# EasyEDA Pro project ProPrj_USB-DAC-PRO_2024-06-16.epro, board PCB1
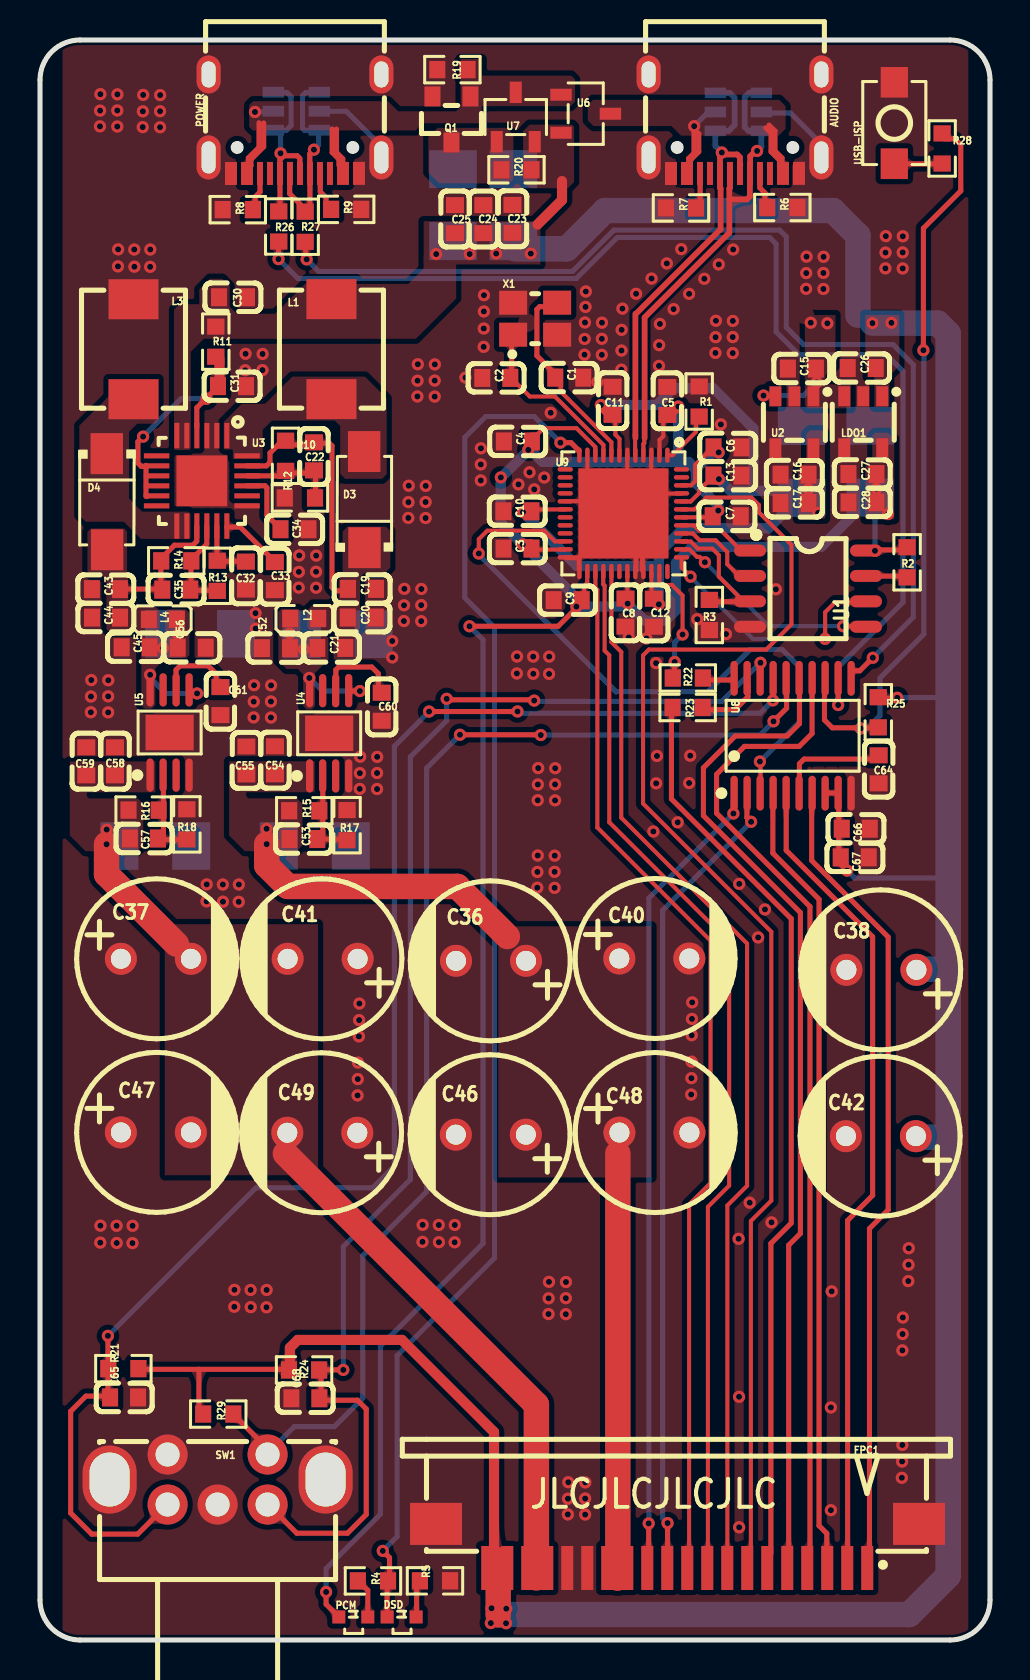
[diagram p6: board, top side]
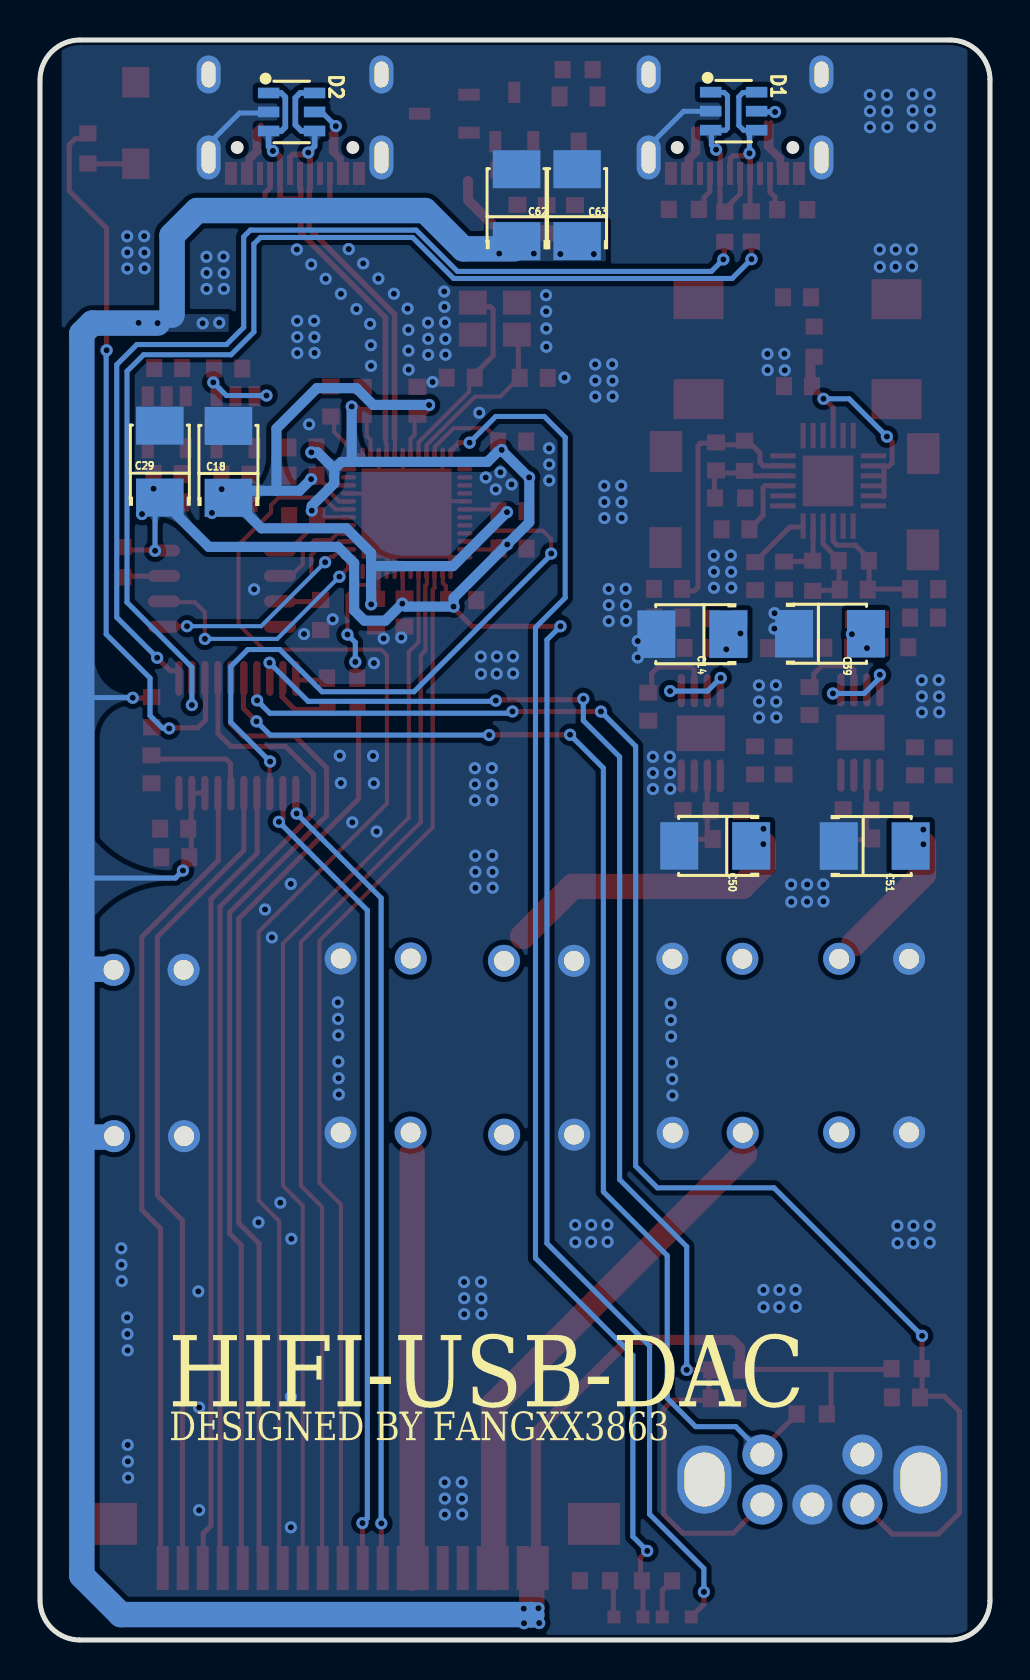
[diagram p7: board, bottom side, seen from below]

Outline 47.5 x 80 mm; copper layers: Top Layer, Bottom Layer. Coordinates in mm from the lower left corner of the outline.
Outline path: 0,78 0,2 arc(0.59,0.59) 2,0 45.5,0 arc(46.91,0.59) 47.5,2 47.5,78 arc(46.91,79.41) 45.5,80 2,80 arc(0.59,79.41) 0,78
Stack: Top Layer 0.035mm - / Dielectric1 1.51mm FR4 er 4.5 / Bottom Layer 0.035mm -

## Design rules (mm)
net USB_D+: AUDIO_USB
net USB_D-: AUDIO_USB
template: 自定义配置
spacing copperThickness1oz (default): track to track 0.102, other pairs 0.152 to 0.3
spacing copperThickness2oz: track to track 0.203, other pairs 0.152 to 0.3
track width copperThickness1oz (default): min 0.127, default 0.254, max 2.54
track width copperThickness2oz: min 0.203, default 0.254, max 2.54
differential pair differentialPair (default): width min 0.127, default 0.254, max 2.54; gap min 0.152, default 0.152
differential pair USB: width min 0.203, default 0.284, max 2.54; gap min 0.152, default 0.152
via viaSize (default): diameter min 0.5, default 0.61, max 10; hole min 0.3, default 0.305, max 6.299
net USB_D+ uses USB
net USB_D- uses USB
diff pair AUDIO_USB uses USB
pour e454 uses USB

## Placement (name value [footprint] x y rotation side)
AUDIO  CQ-USB- TYPE-C 16P母座四脚插板有柱  [USB-C-SMD_CQ-USB-TYPE-C]  34.75 75.8 180 top
C1  20pF  [C0603]  26.46 63.12 0 top
C2  20pF  [C0603]  22.81 63.1 0 top
C3  100nF  [C0603]  23.87 54.57 0 top
C4  100nF  [C0603]  23.89 59.93 0 top
C5  100nF  [C0603]  31.37 61.95 270 top
C6  100nF  [C0603]  34.38 59.63 180 top
C7  100nF  [C0603]  34.34 56.19 180 top
C8  100nF  [C0603]  29.28 51.37 90 top
C9  100nF  [C0603]  26.38 51.99 0 top
C10  100nF  [C0603]  23.87 56.44 0 top
C11  100nF  [C0603]  28.63 61.96 270 top
C12  100nF  [C0603]  30.69 51.36 90 top
C13  100nF  [C0603]  34.37 58.22 180 top
C14  47uF  [CAP-SMD_L3.5-W2.8-FD]  14.88 50.29 0 bottom
C15  4.7uF  [C0603]  38.09 63.57 0 top
C16  4.7uF  [C0603]  37.73 58.27 0 top
C17  100nF  [C0603]  37.73 56.85 0 top
C18  47uF  [CAP-SMD_L3.5-W2.8-FD]  38.08 58.91 90 bottom
C19  10uF  [C0603]  16.1 52.56 180 top
C20  0.1uF  [C0603]  16.09 51.12 180 top
C21  22uF  [C0603]  14.57 49.6 180 top
C22  56pF  [C0603]  13.7 59.18 90 top
C23  100nF  [C0603]  23.62 71.06 270 top
C24  4.7uF  [C0603]  22.17 71.04 270 top
C25  10uF  [C0603]  20.75 71.04 270 top
C26  4.7uF  [C0603]  41.09 63.6 0 top
C27  4.7uF  [C0603]  41.12 58.3 0 top
C28  100nF  [C0603]  41.12 56.88 0 top
C29  47uF  [CAP-SMD_L3.5-W2.8-FD]  41.51 58.92 90 bottom
C30  4.7uF  [C0603]  9.65 67.14 0 top
C31  0.1uF  [C0603]  9.6 62.69 180 top
C32  220nF  [C0603]  10.3 53.22 90 top
C33  4.7nF  [C0603]  11.74 53.19 90 top
C34  10nF  [C0603]  12.72 55.54 180 top
C35  56pF  [C0603]  6.81 52.52 0 top
C36  470uF  [CAP-TH_BD8.0-P3.50-D0.6-FD]  22.55 33.96 180 top
C37  470uF  [CAP-TH_BD8.0-P3.50-D0.6-FD]  5.79 34.06 0 top
C38  470uF  [CAP-TH_BD8.0-P3.50-D0.6-FD]  42.07 33.51 180 top
C39  47uF  [CAP-SMD_L3.5-W2.8-FD]  8 50.31 180 bottom
C40  470uF  [CAP-TH_BD8.0-P3.50-D0.6-FD]  30.72 34.07 0 top
C41  470uF  [CAP-TH_BD8.0-P3.50-D0.6-FD]  14.13 34.06 180 top
C42  470uF  [CAP-TH_BD8.0-P3.50-D0.6-FD]  42.05 25.19 180 top
C43  10uF  [C0603]  3.3 52.54 0 top
C44  0.1uF  [C0603]  3.3 51.12 0 top
C45  22uF  [C0603]  4.78 49.63 0 top
C46  470uF  [CAP-TH_BD8.0-P3.50-D0.6-FD]  22.54 25.27 180 top
C47  470uF  [CAP-TH_BD8.0-P3.50-D0.6-FD]  5.79 25.38 0 top
C48  470uF  [CAP-TH_BD8.0-P3.50-D0.6-FD]  30.72 25.37 0 top
C49  470uF  [CAP-TH_BD8.0-P3.50-D0.6-FD]  14.12 25.36 180 top
C50  47uF  [CAP-SMD_L3.5-W2.8-FD]  13.74 39.7 0 bottom
C51  47uF  [CAP-SMD_L3.5-W2.8-FD]  5.76 39.7 180 bottom
C52  10uF  [C0603]  11.8 49.59 0 top
C53  10nF  [C0603]  13.17 40.05 180 top
C54  0.1uF  [C0603]  11.75 43.98 270 top
C55  10uF  [C0603]  10.32 43.97 270 top
C56  10uF  [C0603]  7.58 49.62 180 top
C57  10nF  [C0603]  5.2 40.08 180 top
C58  0.1uF  [C0603]  3.75 43.93 270 top
C59  10uF  [C0603]  2.31 43.93 270 top
C60  10nF  [C0603]  17.09 46.66 90 top
C61  10nF  [C0603]  9.02 46.94 90 top
C62  47uF  [CAP-SMD_L3.5-W2.8-FD]  23.67 71.74 90 bottom
C63  47uF  [CAP-SMD_L3.5-W2.8-FD]  20.65 71.74 90 bottom
C64  100nF  [C0603]  41.93 43.53 270 top
C65  100nF  [C0603]  4.2 12.13 180 top
C66  22uF  [C0603]  40.79 40.57 180 top
C67  100nF  [C0603]  40.74 39.13 180 top
C68  100nF  [C0603]  13.27 12.09 0 top
D1  TPUSBLC6-4SC6  [SOT-23-6_L2.9-W1.6-P0.95-LS2.8-BL]  12.82 76.44 270 bottom
D2  TPUSBLC6-4SC6  [SOT-23-6_L2.9-W1.6-P0.95-LS2.8-BL]  34.92 76.4 270 bottom
D3  SS34  [SMA_L4.3-W2.6-LS5.0-RD]  16.22 57.02 90 top
D4  SS34  [SMA_L4.3-W2.6-LS5.0-RD]  3.35 56.91 270 top
DSD  侧发绿光LEDD0602  [LED-SMD_L1.6-W1.1-R-RD_BLUE]  18.08 1.15 180 top
FPC1  AFA07-S20FCC-00  [FPC-SMD_AFA07-S20FCC-00]  31.88 4.7 180 top
L1  4.7uH  [IND-SMD_L5.9-W5.2_MAPM0530F]  14.57 64.54 270 top
L2  4.7uH  [L0603]  13.21 51.07 180 top
L3  4.7uH  [IND-SMD_L5.9-W5.2_MAPM0530F]  4.67 64.54 270 top
L4  4.7uH  [L0603]  6.14 51.03 0 top
LDO1  LP5907MFX-3.3/NOPB  [SOT-23-5_L3.0-W1.7-P0.95-LS2.8-BR]  41.16 60.89 90 top
PCM  侧发蓝光LEDD0602  [LED-SMD_L1.6-W1.1-R-RD_BLUE]  15.67 1.15 180 top
POWER  CQ-USB- TYPE-C 16P母座四脚插板有柱  [USB-C-SMD_CQ-USB-TYPE-C]  12.75 75.8 180 top
Q1  AO3402  [SOT-23_L2.9-W1.3-P1.90-LS2.4-BR]  20.57 76.03 90 top
R1  1.8K  [R0603]  32.96 61.92 270 top
R2  10K  [R0603]  43.36 53.89 90 top
R3  10K  [R0603]  33.47 51.25 90 top
R4  470R  [R0603]  16.65 2.95 180 top
R5  470R  [R0603]  19.75 2.96 180 top
R6  5.1K  [R0603]  37.12 71.62 180 top
R7  5.1K  [R0603]  32.05 71.6 0 top
R8  5.1K  [R0603]  9.89 71.52 0 top
R9  5.1K  [R0603]  15.31 71.53 180 top
R10  620K  [R0603]  12.28 59.21 90 top
R11  100R  [R0603]  8.79 64.92 270 top
R12  56K  [R0603]  13 57.1 0 top
R13  18K  [R0603]  8.86 53.21 270 top
R14  220K  [R0603]  6.81 53.96 0 top
R15  120K  [R0603]  13.21 41.46 180 top
R16  120K  [R0603]  5.18 41.5 180 top
R17  11K  [R0603]  15.35 40.74 270 top
R18  11K  [R0603]  7.34 40.78 270 top
R19  1K  [R0603]  20.62 78.52 180 top
R20  1K  [R0603]  23.82 73.51 0 top
R21  10K  [R0603]  4.17 13.57 0 top
R22  1K  [R0603]  32.39 48.1 180 top
R23  1K  [R0603]  32.38 46.62 180 top
R24  10K  [R0603]  13.2 13.5 180 top
R25  10K  [R0603]  41.91 46.39 90 top
R26  22R  [R0603]  11.94 70.68 90 top
R27  22R  [R0603]  13.26 70.66 90 top
R28  300R  [R0603]  45.11 74.58 90 top
R29  10K  [R0603]  8.91 11.3 0 top
SW1  EC11B15242AZ  [SW-TH_EC11B1524XX]  8.88 8.02 270 top
U1  GD25Q40CSIGR  [SOP-8_L4.9-W3.9-P1.27-LS6.0-BR]  38.4 52.57 180 top
U2  LP5907MFX-1.2/NOPB  [SOT-23-5_L3.0-W1.7-P0.95-LS2.8-BR]  37.72 60.88 90 top
U3  TPS65131RGER  [QFN24_L]  8.09 57.96 270 top
U4  TPS7A4901DGNR  [MSOP-8_L3.0-W3.0-P0.65-LS5.0-BL-EP]  14.46 45.34 0 top
U5  TPS7A3001DGNR  [MSOP-8_L3.0-W3.0-P0.65-LS5.0-BL-EP]  6.48 45.38 0 top
U6  AO3401  [SOT-23-3_L2.9-W1.6-P1.90-LS2.8-BR]  27.29 76.32 180 top
U7  AO3401  [SOT-23-3_L2.9-W1.6-P1.90-LS2.8-BR]  23.79 76.15 270 top
U8  STC8H8K64U-45I-TSSOP20  [TSSOP-20_L6.5-W4.4-P0.65-LS6.4-BL]  37.63 45.21 0 top
U9  CT7601SR-QFN48  [qfn-48_l6.0-w6.0-p0.40-tl-ep4.5]  29.17 56.33 270 top
USB-ISP  -  [Key_SMD_3x4x2]  42.71 75.85 90 top
X1  12MHz  [OSC-SMD_4P-L3.2-W2.5-BL-1]  24.76 66.06 0 top

## Footprints (pads in the part's own frame, mm; a bottom-side part is the same pattern mirrored in y, then rotated)
C0603
  rect 0.8x0.9 smd: 1(-0.7,0) 2(0.7,0)
CAP-SMD_L3.5-W2.8-FD
  rect 1.9x2.376 smd: 1(-1.798,0) 2(1.798,0)
CAP-TH_BD8.0-P3.50-D0.6-FD
  round 1.6 hole 1: 1(-1.75,0) 2(1.75,0)
FPC-SMD_AFA07-S20FCC-00
  rect 0.6x2.2 smd: 1(-9.486,1.103) 2(-8.486,1.103) 3(-7.484,1.103) 4(-6.486,1.103) 5(-5.486,1.103) 6(-4.486,1.101) 7(-3.486,1.103) 8(-2.486,1.103) 9(-1.487,1.102) 10(-0.487,1.102) 11(0.513,1.102) 12(1.513,1.102) 13(2.513,1.102) 14(3.513,1.102) 15(4.515,1.101) 16(5.514,1.102) 17(6.514,1.102) 18(7.514,1.102) 19(8.514,1.102) 20(9.513,1.102)
  rect 2.6x2.1 smd: 21(-12.075,-1.103) 22(12.075,-1.103)
IND-SMD_L5.9-W5.2_MAPM0530F
  rect 2x2.5 smd: 1(-2.5,0) 2(2.5,0)
Key_SMD_3x4x2
  rect 1.53x1.36 smd: 1(-2.035,0) 2(2.035,0)
L0603
  rect 0.8x0.864 smd: 1(-0.7,0) 2(0.7,0)
LED-SMD_L1.6-W1.1-R-RD_BLUE
  rect 0.65x0.65 smd: 1(0.725,0) 2(-0.725,0)
MSOP-8_L3.0-W3.0-P0.65-LS5.0-BL-EP
  oval 0.364x1.662 smd: 1(-0.975,-2.131) 2(-0.325,-2.131) 3(0.325,-2.131) 4(0.975,-2.131) 5(0.975,2.131) 6(0.325,2.131) 7(-0.325,2.131) 8(-0.975,2.131)
  rect 2.41x1.78 smd: 9(0,0)
OSC-SMD_4P-L3.2-W2.5-BL-1
  rect 1.4x1.2 smd: 1(-1.1,-0.8) 2(1.1,-0.8) 3(1.1,0.8) 4(-1.1,0.8)
QFN24_L
  rect 1.27x0.254 smd: 1(-2.26,1.25) 2(-2.261,0.75) 3(-2.261,0.251) 4(-2.261,-0.251) 5(-2.263,-0.75) 6(-2.264,-1.252) 13(2.26,-1.25) 14(2.26,-0.75) 15(2.26,-0.25) 16(2.26,0.25) 17(2.26,0.75) 18(2.26,1.25)
  rect 0.254x1.27 smd: 7(-1.25,-2.261) 8(-0.75,-2.261) 9(-0.25,-2.261) 10(0.25,-2.261) 11(0.75,-2.261) 12(1.25,-2.261) 19(1.25,2.261) 20(0.75,2.261) 21(0.25,2.261) 22(-0.25,2.261) 23(-0.75,2.261) 24(-1.25,2.261)
  rect 2.54x2.54 smd: 25(0,0)
qfn-48_l6.0-w6.0-p0.40-tl-ep4.5
  oval 0.765x0.224 smd: 1(-2.908,2.2) 2(-2.908,1.8) 3(-2.908,1.4) 4(-2.908,1) 5(-2.908,0.6) 6(-2.908,0.2) 7(-2.908,-0.2) 8(-2.908,-0.6) 9(-2.908,-1) 10(-2.908,-1.4) 11(-2.908,-1.8) 12(-2.908,-2.2) 25(2.908,-2.2) 26(2.908,-1.8) 27(2.908,-1.4) 28(2.908,-1) 29(2.908,-0.6) 30(2.908,-0.2) 31(2.908,0.2) 32(2.908,0.6) 33(2.908,1) 34(2.908,1.4) 35(2.908,1.8) 36(2.908,2.2)
  oval 0.224x0.765 smd: 13(-2.2,-2.908) 14(-1.8,-2.908) 15(-1.4,-2.908) 16(-1,-2.908) 17(-0.6,-2.908) 18(-0.2,-2.908) 19(0.2,-2.908) 20(0.6,-2.908) 21(1,-2.908) 22(1.4,-2.908) 23(1.8,-2.908) 24(2.2,-2.908) 37(2.2,2.908) 38(1.8,2.908) 39(1.4,2.908) 40(1,2.908) 41(0.6,2.908) 42(0.2,2.908) 43(-0.2,2.908) 44(-0.6,2.908) 45(-1,2.908) 46(-1.4,2.908) 47(-1.8,2.908) 48(-2.2,2.908)
  rect 4.5x4.5 smd: 49(0,0)
R0603
  rect 0.806x0.864 smd: 1(-0.753,0) 2(0.753,0)
SMA_L4.3-W2.6-LS5.0-RD
  rect 2.046x1.62 smd: 1(-2.404,-0.009) 2(2.404,0.009)
SOP-8_L4.9-W3.9-P1.27-LS6.0-BR
  oval 1.6x0.6 smd: 1(2.9,-1.905) 2(2.9,-0.635) 3(2.9,0.635) 4(2.9,1.905) 5(-2.9,1.905) 6(-2.9,0.635) 7(-2.9,-0.635) 8(-2.9,-1.905)
SOT-23-3_L2.9-W1.6-P1.90-LS2.8-BR
  rect 1.07x0.6 smd: 1(1.235,-0.95) 2(1.235,0.95) 3(-1.235,0)
SOT-23-5_L3.0-W1.7-P0.95-LS2.8-BR
  rect 1x0.6 smd: 1(1.3,-0.95) 2(1.3,0) 3(1.3,0.95) 4(-1.3,0.95) 5(-1.3,-0.95)
SOT-23-6_L2.9-W1.6-P0.95-LS2.8-BL
  rect 0.532x1.072 smd: 1(-0.95,-1.149) 2(0,-1.149) 3(0.95,-1.149) 4(0.95,1.149) 5(0,1.149) 6(-0.95,1.149)
SOT-23_L2.9-W1.3-P1.90-LS2.4-BR
  rect 1x0.8 smd: 1(1.15,-0.95) 2(1.15,0.95) 3(-1.15,0)
SW-TH_EC11B1524XX
  round 2 hole 1.2: A(1.25,-2.5) B(1.25,2.5) C(1.25,-0.001) D(-1.25,-2.5) E(-1.25,2.5)
  oval 3.4x2.7 hole 2.7x2: EH(0,5.4) EH(0,-5.4)
TSSOP-20_L6.5-W4.4-P0.65-LS6.4-BL
  oval 0.364x1.742 smd: 1(-2.925,-2.871) 2(-2.275,-2.871) 3(-1.625,-2.871) 4(-0.975,-2.871) 5(-0.325,-2.871) 6(0.325,-2.871) 7(0.975,-2.871) 8(1.625,-2.871) 9(2.275,-2.871) 10(2.925,-2.871) 11(2.925,2.871) 12(2.275,2.871) 13(1.625,2.871) 14(0.975,2.871) 15(0.325,2.871) 16(-0.325,2.871) 17(-0.975,2.871) 18(-1.625,2.871) 19(-2.275,2.871) 20(-2.925,2.871)
USB-C-SMD_CQ-USB-TYPE-C
  oval 1.2x2.2 hole 0.7x1.6: 0(-4.32,1.675) 0(4.32,1.675)
  oval 1.2x1.9 hole 0.7x1.3: 0(-4.32,-2.475) 0(4.32,-2.475)
  rect 0.6x1.15 smd: A1B12(-3.2,2.471) A4B9(-2.4,2.471) B1A12(3.2,2.475) B4A9(2.4,2.475)
  rect 0.3x1.15 smd: A5(-1.25,2.475) A6(-0.25,2.475) A7(0.25,2.474) A8(1.25,2.475) B5(1.75,2.475) B6(0.75,2.475) B7(-0.75,2.473) B8(-1.75,2.475)

## Nets
As in the schematic.

Pads without a net: AUDIO A8 B8; POWER A8 B8; U3 7 12 20; U4 3 7; U5 3 7; U9 13 19 20 21 47 48

## Via types
v1: diameter 0.61, hole 0.305, Top Layer to Bottom Layer, 309 vias

## Routing (per net, layer and track width the routed paths; a pad name or vN(x,y) marks a point on that pad's centre or on a via; arc(x,y) is an arc through that point)
5V: length 166.6
  Top Layer w0.254: v1(40.35,38.47) 40.01,38.82 40.01,39.07 40.08,39.15 ; v1(36.18,62.22) 36.18,62.21 36.75,62.21 ; 4.96,13.62 5.04,13.53 7.95,13.53 ; v1(42.86,47.11) 42.84,47.09 41.86,47.09 ; 8.02,11.57 7.95,11.65 7.95,13.53 ; 7.95,13.53 12.5,13.53 ; 39.92,39.12 39.94,39.14 39.94,41.97 ; 39.3,42.35 39.84,42.35 39.93,42.25
  Top Layer w0.508: 22.7,3.39 22.7,10.4 18.09,15 12.89,15 12.5,14.61 12.5,13.64 ; 24.87,70.77 26.1,72 26.1,72.95
  Top Layer w1.27: 22.84,4.04 22.91,3.97 22.91,1.26
  Bottom Layer w0.254: 45.41,38.1 40.73,38.1 v1(40.35,38.47) ; v1(38.84,62.88) 38.18,62.22 v1(36.18,62.22) ; 45.19,47.12 42.87,47.12 v1(42.86,47.11)
  Bottom Layer w1.27: 22.91,1.26 22.93,1.27 43.46,1.27 45.41,3.22 45.41,25.14 ; 45.41,33.54 45.41,25.14 ; 45.41,33.54 45.41,65.32 44.89,65.84 v1(41.62,65.84) ; 45.41,33.54 44.05,33.54 44.02,33.51 ; 45.41,25.14 43.82,25.14 ; 40.9,66.24 40.9,70.23 39.65,71.47 28.25,71.47 26.34,69.56 23.77,69.56
  vias: v1(19.81,69.3) v1(21.48,69.3) v1(22.58,1.59) v1(22.54,0.85) v1(22.81,69.32) v1(23.31,1.57) v1(23.3,0.84) v1(24.54,69.32) v1(38.54,65.86) v1(39.37,65.83) v1(42.57,65.86)
+15V: length 3.3
  Top Layer w0.254: v1(15.99,47.45) 15.99,47.45 15.45,47.45
  Bottom Layer w0.254: v1(15.99,47.45) 14.12,47.45 v1(13.47,48.1)
  vias: v1(12.48,50.33) v1(13.19,49.53)
-15V: length 3.2
  Top Layer w0.254: 7.5,47.33 v1(7.85,47.33)
  Bottom Layer w0.254: v1(5.51,48.26) 5.51,48.11 6.29,47.33 v1(7.85,47.33)
  vias: v1(6.15,49.59) v1(6.91,50.29)
GND: length 16.4
  Top Layer w0.203: 30.54,58.28 30.56,58.3 30.56,59.19 ; 27.52,56.83 27.41,56.94 26.3,56.94 ; 30.77,57.34 30.79,57.32 32.09,57.32 ; 27.37,59.01 27.37,58.16 27.35,58.15 ; 29.36,59.25 29.36,58.14 29.36,58.13
  Top Layer w0.254: 30.13,53.48 30.13,54.41 30.11,54.42 ; 26.96,53.54 26.96,54.1 ; 26.96,54.1 26.97,54.09 ; 26.96,54.1 26.95,54.11 26.3,54.11 ; 26.96,54.1 26.96,54.12 27.2,54.37 ; 29.8,54.57 29.8,53.5 29.79,53.48
  Bottom Layer w0.254: 14.16,76.44 15.32,76.44 16.88,74.87 ; 36.08,76.35 37.52,76.35 39.1,74.77 39.1,74.56
  vias: v1(2.56,48) v1(2.55,47.17) v1(2.54,46.39) v1(3,75.68) v1(3.02,77.29) v1(3,76.47) v1(3.02,20.72) v1(3.01,19.87) v1(3.41,47.99) v1(3.41,47.18) v1(3.41,46.38) v1(3.87,77.28) v1(3.86,76.48) v1(3.86,75.68) v1(3.9,68.68) v1(3.83,20.71) v1(3.83,19.85) v1(3.91,69.53) v1(4.63,20.71) v1(4.62,19.84) v1(4.71,69.52) v1(4.72,68.66) v1(5.16,77.25) v1(5.14,76.43) v1(5.14,75.64) v1(5.51,69.52) v1(5.51,68.66) v1(6.01,77.25) v1(6,76.44) v1(6,75.64) v1(8.33,37.78) v1(8.33,36.93) v1(9.14,37.77) v1(9.15,36.91) v1(9.72,17.51) v1(9.71,16.66) v1(9.94,37.77) v1(9.94,36.91) v1(10.28,64.31) v1(10.26,63.49) v1(10.53,17.5) v1(10.54,16.64) v1(10.69,46.92) v1(10.68,46.13) v1(10.77,51.34) v1(10.78,50.57) v1(10.7,47.74) v1(11.13,64.3) v1(11.12,63.49) v1(11.33,17.5) v1(11.32,16.64) v1(11.55,47.73) v1(11.55,46.92) v1(11.55,46.12) v1(12.96,54.23) v1(12.94,53.41) v1(12.94,52.62) v1(13.81,54.22) v1(13.8,53.41) v1(13.8,52.61) v1(15.89,28.05) v1(15.88,27.23) v1(15.99,43.34) v1(15.99,42.56) v1(15.97,31.82) v1(15.96,31) v1(15.94,30.18) v1(15.9,28.87) v1(16.01,44.16) v1(16.86,44.16) v1(16.85,43.35) v1(16.85,42.55) v1(17.61,49.95) v1(17.61,49.13) v1(18.19,50.95) v1(18.22,52.56) v1(18.2,51.74) v1(18.44,57.71) v1(18.42,56.89) v1(18.41,56.1) v1(18.89,63.79) v1(18.88,62.97) v1(18.87,62.18) v1(19.07,52.55) v1(19.06,51.74) v1(19.06,50.94) v1(19.13,20.76) v1(19.12,19.91) v1(19.29,57.71) v1(19.28,56.9) v1(19.28,56.1) v1(19.74,63.78) v1(19.73,62.97) v1(19.73,62.17) v1(19.94,20.75) v1(19.94,19.89) v1(20.74,20.75) v1(20.73,19.88) v1(21.27,63.12) v1(22.04,59.59) v1(22.04,58.78) v1(22.04,57.98) v1(22.2,67.24) v1(22.19,66.43) v1(22.19,65.57) v1(22.18,64.66) v1(23.85,49.18) v1(23.84,48.33) v1(23.92,57.78) v1(24.48,58.39) v1(24.66,49.17) v1(24.66,48.31) v1(24.71,57.53) v1(24.89,42.77) v1(24.89,41.99) v1(24.89,39.22) v1(24.87,38.4) v1(24.86,37.62) v1(24.91,43.6) v1(25.21,58.12) v1(25.46,49.17) v1(25.45,48.3) v1(25.45,17.91) v1(25.43,17.08) v1(25.43,16.3) v1(25.54,61.36) v1(25.76,43.59) v1(25.75,42.78) v1(25.75,41.98) v1(25.74,39.22) v1(25.73,38.41) v1(25.73,37.61) v1(26.3,17.9) v1(26.29,17.09) v1(26.29,16.29) v1(26.4,7.07) v1(26.39,6.28) v1(26.41,7.89) v1(27.29,67.42) v1(27.28,66.65) v1(27.25,65.87) v1(27.23,65.05) v1(27.22,64.27) v1(27.26,7.88) v1(27.26,7.07) v1(27.26,6.27) v1(27.87,62.9) v1(28.1,65.87) v1(28.09,65.06) v1(28.09,64.26) v1(29.08,65.51) v1(29.07,64.47) v1(29.07,63.52) v1(29.12,66.57) v1(29.44,50.13) v1(29.8,67.31) v1(30.32,50.08) v1(30.58,68.07) v1(30.67,40.42) v1(30.8,48.84) v1(30.85,44.2) v1(30.81,42.83) v1(31,65.8) v1(30.96,64.74) v1(30.95,63.71) v1(31.34,68.83) v1(31.68,66.54) v1(31.89,40.88) v1(32.06,69.54) v1(32.45,67.31) v1(32.46,42.85) v1(32.51,44.22) v1(32.6,31.05) v1(32.59,30.24) v1(32.58,28.92) v1(32.57,28.09) v1(32.56,27.27) v1(32.61,31.88) v1(32.86,51.04) v1(33.22,68.06) v1(33.79,65.96) v1(33.78,65.14) v1(33.77,64.35) v1(33.94,68.78) v1(34.04,60.78) v1(34.3,50.3) v1(34.66,69.53) v1(34.64,65.95) v1(34.64,65.15) v1(34.64,64.35) v1(34.96,37.81) v1(34.93,20.06) v1(34.95,12.16) v1(34.96,5.64) v1(35.48,21.86) v1(35.91,35.13) v1(36.25,36.53) v1(36.58,20.88) v1(36.79,52.54) v1(38.33,69.17) v1(38.31,68.35) v1(38.31,67.56) v1(39.18,69.16) v1(39.17,68.35) v1(39.17,67.55) v1(39.58,17.43) v1(39.54,11.63) v1(39.54,6.49) v1(42.29,70.19) v1(42.28,69.37) v1(42.27,68.58) v1(43.09,8.11) v1(43.14,70.19) v1(43.14,69.38) v1(43.14,68.58) v1(43.14,16.12) v1(43.13,15.3) v1(43.12,14.48) v1(43.12,9.75) v1(43.1,8.93) v1(43.44,19.59) v1(43.43,18.76) v1(43.41,17.95)
VDD12: length 41.5
  Top Layer w0.203: 28.97,59.23 28.97,60.06 28.77,60.27 28.77,61.08 28.75,61.09 ; 26.28,56.53 24.82,56.53 24.82,56.18 ; 30.57,53.36 30.57,52.1 30.59,52.08 ; 28.97,61.11 28.94,61.08 ; 32.05,56.92 32.53,56.92 32.95,57.34 32.95,57.48 33.37,57.9 33.42,57.9
  Top Layer w0.508: v1(28.04,61.75) 28.35,61.44 28.44,61.44 ; v1(33.94,58.04) 33.64,58.04
  Bottom Layer w0.508: 35.68,57.46 37.67,57.46 ; 35.68,57.46 34.52,57.46 v1(33.94,58.04) ; 35.68,57.46 35.68,60.57 33.66,62.59 31.68,62.59 30.84,61.76 28.05,61.76 v1(28.04,61.75) ; 30.94,53.7 30.94,54.35 32.18,55.59 36.42,55.59 37.36,56.53 ; 30.94,53.7 v1(30.94,51.78) ; 30.94,53.7 26.85,53.7 v1(24.15,56.39)
  vias: v1(38.42,57.54) v1(38.91,56.36)
VDD33: length 122.4
  Top Layer w0.203: 27.77,59.25 27.77,59.65 26.82,60.59 25.18,60.59 24.86,60.27 24.58,60.27 ; 29.35,52.09 29.37,52.11 29.37,53.32 ; 27.36,53.42 27.36,52.85 27.21,52.7 27.21,52.25 27.22,52.23 ; 26.25,54.52 24.65,54.52 24.64,54.51 ; 32.1,56.13 33.5,56.13 33.51,56.14 ; 32.08,57.73 32.56,57.73 32.76,57.94 32.76,58.77 33.64,59.64 ; 31.03,61.18 31.16,61.05 31.16,60.19 30.98,60 30.98,59.22
  Top Layer w0.254: 41.33,54.5 43.09,54.5 43.18,54.6 ; 14.92,1.17 14.31,1.79 v1(14.31,2.4) ; 26.92,51.7 25.91,50.69 v1(21.47,50.69)
  Top Layer w0.508: 31.52,61.33 31.86,61.67 v1(31.92,61.67) ; 24.65,54.68 24.55,54.78 v1(24.14,54.78)
  Bottom Layer w0.254: 41.62,56.53 41.75,56.41 v1(41.75,54.46) ; v1(14.31,2.4) 14.31,3.57 17.02,6.29 17.02,14.7 22.15,19.83 22.15,50.01 v1(21.47,50.69)
  Bottom Layer w0.508: 23.24,58.3 24.35,59.41 24.5,59.41 ; 23.04,57.9 23.04,55.88 v1(24.14,54.78) 26.82,52.1 v1(26.82,51.67) 29.23,51.67 v1(29.38,51.82) 30.23,50.97 31.28,50.97 31.79,51.48 31.79,53.84 32.61,54.66 39.06,54.66 41.08,56.68 ; 24.5,59.41 24.61,59.41 25.12,58.91 31.85,58.91 ; 24.5,59.41 v1(24.41,59.5) ; v1(33.93,59.38) 33.62,59.38 32.79,58.55 ; v1(31.92,61.67) 31.92,58.97 31.85,58.91 ; 31.85,58.91 32.43,58.91 32.79,58.55 ; 32.79,58.55 32.79,57.83 33.91,56.71 v1(33.91,56.47)
  vias: v1(23.04,58.13) v1(41.82,57.57) v1(42.4,56.3)
+VO: length 35.8
  Top Layer w1.27: v1(11.33,39.79) 11.33,38.73 12.38,37.68 20.87,37.68 23.37,35.17 ; 28.89,24.32 28.89,3.11 28.88,3.1
  vias: v1(11.33,40.56)
-VO: length 32.8
  Top Layer w1.27: 6.82,34.79 3.33,38.29 v1(3.33,39.79) ; 24.82,3.1 24.82,11.77 12.27,24.32
  vias: v1(3.33,40.52)
CT7601_TX: length 6
  Top Layer w0.203: 30.96,53.26 30.97,53.26 30.97,52.85 31.07,52.75 31.6,52.75 32.13,52.22 v1(32.13,50.27)
  Top Layer w0.254: v1(31.73,48.9) 31.71,48.88 31.71,48.24
  Bottom Layer w0.254: v1(31.73,48.9) 31.73,49.88 v1(32.13,50.27)
DAC_DATA/DSD_DATA_R: length 52.2
  Top Layer w0.203: 28.16,53.44 28.16,52.78 28.23,52.71 28.23,49.47 28.46,49.24 28.46,40.89 34.46,34.89 34.46,22.72 33.4,21.66 33.4,4.25
DAC_LRCK/DSD_DATA_L: length 52.2
  Top Layer w0.203: 32.36,4.08 32.45,4.18 32.45,21.78 33.53,22.85 33.53,34.97 27.87,40.62 27.87,52.51 27.77,52.61 27.77,53.42
DAC_RST: length 45.2
  Top Layer w0.254: 31.57,46.56 31.57,42.05 37.56,36.06 37.56,20.85 36.54,19.83 36.54,4.31
DAC_SCLK/DSD_SCLK: length 52.6
  Top Layer w0.203: 34.36,4.04 34.37,4.05 34.37,21.72 35.35,22.71 35.35,34.82 29.06,41.11 29.06,49.4 28.57,49.89 28.57,53.38
DSD_FLG: length 68.7
  Top Layer w0.254: 17.47,3.08 17.47,4.12 v1(17.14,4.45) ; 17.44,1.23 17.36,1.32 17.36,2.85 ; 26.95,59.39 26.95,59.46 26.55,59.87 v1(26.02,59.87)
  Bottom Layer w0.254: v1(26.02,59.87) 24.71,61.18 22.29,61.18 21.24,60.13 21.24,52.11 22.72,50.63 22.72,19.09 17.86,14.23 17.86,5.17 v1(17.14,4.45)
EC_A: length 75.9
  Top Layer w0.254: 3.4,13.6 v1(3.4,15.21) 3.38,15.23 ; 3.4,13.6 3.41,13.62 ; 3.4,13.6 3.4,12.19 ; 3.55,12.19 3.4,12.19 ; 3.4,12.19 2.29,12.19 1.53,11.43 1.53,6.35 2.59,5.29 4.89,5.29 6.1,6.51 ; 3.4,12.19 3.4,12.01 ; v1(36.64,46.98) 36.64,47.91 36.66,47.93 ; v1(23.88,46.43) 23.87,46.42 v1(19.45,46.42)
  Bottom Layer w0.254: v1(36.64,46.98) 36,46.34 23.96,46.34 v1(23.88,46.43) ; v1(19.45,46.42) 17.72,44.69 17.72,23.7 16.63,22.61 10.8,22.61 v1(3.4,15.21)
EC_B: length 68.8
  Top Layer w0.254: 36,47.89 36.02,47.91 v1(36.02,48.86) ; v1(24.71,46.97) 24.67,47.01 20.38,47.01 v1(20.33,47.06) ; v1(15.16,13.5) 15.16,13.51 14.06,13.51 14.06,12.24 13.98,12.16 ; 14.03,11.99 15.87,11.99 16.31,11.55 16.31,6.28 15.37,5.34 12.84,5.34 11.77,6.41
  Bottom Layer w0.254: v1(20.33,47.06) 20.33,45.97 18.52,44.16 18.52,23.03 15.16,19.67 v1(15.16,13.5) ; v1(24.71,46.97) 24.75,46.93 34.09,46.93 v1(36.02,48.86)
EC_SW: length 61
  Top Layer w0.254: v1(36.68,45.93) 37.33,46.59 37.33,47.46 ; v1(25.04,45.25) 25.03,45.26 v1(21,45.26) ; 9.69,11.26 11.18,9.76 11.18,9.47
  Bottom Layer w0.254: 11.55,9.51 12.71,10.67 14.72,10.67 16.14,12.09 16.14,19.22 19.33,22.41 19.33,43.6 v1(21,45.26) ; v1(36.68,45.93) 35.99,45.25 v1(25.04,45.25)
MCU_DN: length 7.5
  Top Layer w0.254: 13.49,73.76 13.49,74.31 v1(13.7,74.52) ; 13.48,71.63 13.5,71.65 13.5,72.94 ; 13.03,71.77 12.48,72.32 12.48,72.98
  Bottom Layer w0.254: 13.88,77.38 13.29,77.38 13.12,77.21 13.12,75.59 13.23,75.49 13.52,75.49 13.52,75.49 ; 13.93,75.42 13.93,74.75 v1(13.7,74.52)
MCU_DP: length 7.3
  Top Layer w0.254: 12.99,73.7 12.99,74.08 12.86,74.21 12.2,74.21 11.99,74.01 11.99,73.62 ; 12,73.09 12,71.59 11.99,71.58
  Bottom Layer w0.254: v1(12.03,74.34) 12.03,75.42 11.97,75.47 ; 11.97,77.37 12.35,77.37 12.56,77.16 12.56,75.73 12.3,75.47 12.03,75.47 12.01,75.49
MUTE: length 32.3
  Top Layer w0.203: 36.03,42.72 36.03,43.89 v1(35.99,43.92) ; v1(21.94,54.32) 21.94,55.04 22.36,55.47 25.21,55.47 25.75,54.93 26.26,54.93
  Bottom Layer w0.254: v1(21.94,54.32) 21.98,54.29 21.98,54.23 28.8,47.41 33.4,47.41 35.51,49.52 37.11,49.52 37.96,48.67 37.96,45.89 v1(35.99,43.92)
SCL: length 39.9
  Top Layer w0.254: v1(31.38,5.85) 31.38,4.05 31.36,4.03 ; 35.34,41.89 35.34,41.12 v1(35.55,40.91)
  Bottom Layer w0.254: v1(31.38,5.85) 31.13,6.09 31.13,36.49 v1(35.55,40.91)
SDA: length 39.4
  Top Layer w0.254: 30.46,4.44 30.43,4.47 v1(30.43,5.83) ; 34.67,41.32 34.67,42.07
  Bottom Layer w0.254: v1(30.43,5.83) 30.44,5.84 30.44,37.1 v1(34.67,41.32)
SPDIF_OUT: length 67.2
  Top Layer w0.203: 35.54,4.09 35.54,20.95 36.56,21.97 36.56,35.41 30.15,41.82 30.15,49.23 30.44,49.52 36.31,49.52 37.57,50.79 37.57,54.75 35.95,56.38 35.95,56.75 35.57,57.12 33.32,57.12 32.72,56.53 32.08,56.53
SPI_CLK: length 12.4
  Top Layer w0.203: 40.99,51.91 40.97,51.89 39.76,51.89 39.26,51.39 v1(39.26,50.05) ; 32.08,54.11 32.08,53.61 v1(32.53,53.17)
  Bottom Layer w0.203: v1(39.26,50.05) 35.64,50.05 v1(32.53,53.17)
SPI_CS#: length 3.2
  Top Layer w0.203: 32.08,55.73 32.7,55.73 32.97,55.46 34.07,55.46 34.86,54.67
SPI_MISO: length 4.1
  Top Layer w0.203: 32.1,55.33 32.64,55.33 32.98,54.98 33.78,54.98 34.36,54.4 34.36,53.79 34.94,53.21 35,53.21
SPI_MOSI: length 10.4
  Top Layer w0.203: v1(40.15,50.69) 40.82,50.69 40.88,50.63 ; v1(33.24,53.89) 32.97,54.16 32.85,54.16 32.47,54.53 32.06,54.53
  Bottom Layer w0.203: v1(33.24,53.89) 36.44,50.69 v1(40.15,50.69)
SPI_WP: length 6.4
  Top Layer w0.203: 32.09,54.92 32.54,54.92 32.89,54.57 33.62,54.57 33.94,54.24 33.94,53.17 34.98,52.13
  Top Layer w0.254: 33.48,51.91 35.09,51.91 35.15,51.97
USB_D+: length 22.5
  Top Layer w0.203: 29.77,60.1 29.75,60.08 29.75,59.25 U9.5 ; 29.77,60.24 29.78,60.25
  Top Layer w0.284: 29.77,60.1 29.77,66.31 ; 35.02,73.76 35,73.79 35,74.14 34.86,74.28 34.08,74.28 34,74.2 34,72.61 34.03,72.58 34.03,70.55 29.79,66.31
  Bottom Layer w0.284: D2.6 34.49,77.35 34.73,77.11 34.73,75.75 34.43,75.45 34.19,75.45 ; D2.4 33.77,74.69 v1(34.09,74.37)
USB_D-: length 22.6
  Top Layer w0.203: 30.23,60.1 30.21,60.08 30.21,59.85 30.17,59.81 U9.4
  Top Layer w0.284: v1(35.85,74.45) 35.77,74.45 35.51,74.19 35.51,73.86 35.51,73.85 ; 34.47,72.03 34.47,70.36 30.23,66.13 30.23,60.1 ; 34.47,72.03 35.35,72.03 35.49,72.18 35.49,72.93 35.51,72.95 ; 34.47,72.03 34.47,72.58 34.5,72.61 AUDIO.A7
  Bottom Layer w0.284: 35.68,75.45 35.43,75.45 35.23,75.65 35.23,77.14 35.44,77.35 D2.1 ; v1(35.85,74.45) 36.07,74.67 D2.3
V-BAK: length 9.8
  Top Layer w0.254: 10.95,75.86 10.95,74.64 10.42,74.1 10.42,73.59 ; 14.95,73.74 14.95,74.04 14.61,74.38 14.61,75.55 ; 14.82,75.55 14.82,74.38 15.14,74.07 15.14,73.72 ; 11.18,75.85 11.18,74.66 10.55,74.03 10.55,73.72 10.42,73.59 ; 10.42,73.59 10.31,73.48
  Bottom Layer w0.254: v1(10.75,76.4) 10.75,76.41 11.43,76.41
V-MAIN: length 10.1
  Top Layer w0.254: 32.44,73.66 32.42,73.65 ; 32.44,73.66 32.44,74.08 32.7,74.34 32.7,75.68 v1(32.71,75.69) ; 32.44,73.66 32.52,73.75 32.52,74.04 32.57,74.04 32.94,74.41 32.94,75.32 32.91,75.35 ; 36.29,75.6 36.55,75.33 36.55,74.41 36.97,73.99 36.97,73.63 37,73.6 37.1,73.7 37.1,74.1 36.75,74.45 36.75,75.45 36.45,75.74
  Bottom Layer w0.254: 33.69,76.31 33.32,76.31 v1(32.71,75.69)
VOL-CS: length 40.3
  Top Layer w0.254: 38.58,42.2 38.58,38.97 42.41,35.15 42.41,21.51 41.47,20.57 41.47,3.96 41.41,3.9
VOL-MUTE: length 49.3
  Top Layer w0.254: 38.6,48.13 38.6,45.33 37.96,44.68 35.22,44.68 33.83,43.28 33.83,41.34 38.5,36.67 38.5,4.34
VOL-SCLK: length 39
  Top Layer w0.254: 36.64,42.01 36.64,39.34 38.95,37.03 38.95,5.72 39.34,5.33 39.34,4.29 ; 39.34,4.29 39.48,4.15 ; 39.34,4.29 39.34,4.29
VOL-SDI: length 40.3
  Top Layer w0.254: 40.38,4 40.38,20.98 41.63,22.23 41.63,35.16 37.31,39.48 37.31,42
VOL-ZCEN: length 49.6
  Top Layer w0.254: 37.32,3.88 37.43,3.99 37.43,19.74 38.02,20.33 38.02,36.37 33.17,41.22 33.17,43.61 34.77,45.2 37.36,45.2 37.97,45.82 37.97,47.65
$1N2972: length 2.7
  Top Layer w0.203: 32.8,61.17 32.8,60.41 31.63,59.24 31.36,59.24
$1N5430: length 1.8
  Top Layer w0.254: 43.2,53.17 43.18,53.19 41.4,53.19
$1N28291: length 8.1
  Top Layer w0.203: 23.77,62.89 24.49,62.17 25.75,62.17 28.17,59.75 28.17,59.24
  Top Layer w0.254: 23.58,65.2 23.58,63.31 23.61,63.27
$1N28304: length 9.1
  Top Layer w0.203: 26.04,62.91 26.04,62.42 28.57,59.89 28.57,59.32
  Top Layer w0.254: 25.79,66.67 24.98,66.67 24.84,66.53 24.84,64.22 25.67,63.39
$1N42418: length 1.2
  Top Layer w0.254: 35.99,72.95 35.99,72.61 36.25,72.35 36.25,71.88
$1N42422: length 1.7
  Top Layer w0.254: 32.82,71.45 33.01,71.64 33.01,73.02
$1N47108: length 1.4
  Top Layer w0.254: 14.01,73.02 14.01,72.41 14.3,72.12 14.3,71.74
$1N47109: length 1.3
  Top Layer w0.254: 10.73,71.84 10.75,71.87 10.75,72.15 11,72.4 11,73.03
$1N48705: length 1.7
  Top Layer w0.254: 18.85,2.93 18.83,2.91 18.83,1.2
$1N48706: length 1.9
  Top Layer w0.254: 16.39,1.15 16.39,2.48 16.02,2.85
$5N7404: length 4.5
  Top Layer w0.254: 13.63,58.35 12.25,58.35 12.22,58.32 ; 12.13,58.3 12.04,58.21 10.37,58.21 ; 13.74,57.16 13.78,57.2 13.78,58.38
$5N7406: length 10.9
  Top Layer w0.254: 5.31,58.69 5.3,58.69 ; 5.3,58.69 5.06,58.69 4.9,58.85 4.9,59.91 v1(5.16,60.17) ; 5.3,58.69 5.3,57.2 5.33,57.17 ; 5.3,58.69 5.3,58.73 ; 8.57,62.35 7.84,61.61 7.84,60.66
  Top Layer w0.508: 8.88,62.64 8.97,62.74 8.97,64.09
  Bottom Layer w0.254: v1(8.33,62.06) 7.05,62.06 v1(5.16,60.17)
$5N7410: length 2.7
  Top Layer w0.254: 9.34,55.65 10.01,55.65 11.46,54.19
$5N7416: length 2.9
  Top Layer w0.254: 11.69,55.88 11.35,56.23 11.35,57.61 11.25,57.71 10.35,57.71
$5N7417: length 3
  Top Layer w0.254: 8.86,54.18 8.85,54.2 8.85,55.69 ; 8.85,53.93 10.32,53.93 10.37,53.89
$5N7419: length 4
  Top Layer w0.254: 14.79,47.66 14.79,48.5 14.94,48.65 16.59,48.65 16.91,48.32 16.91,47.59 16.96,47.54
$5N7421: length 4.4
  Top Layer w0.254: 14.14,42.88 14.14,40.09 14.09,40.04 15.46,40.04 15.55,39.94
$5N7426: length 3.2
  Top Layer w0.254: 6.8,48.09 6.8,48.51 7,48.71 8.41,48.71 8.81,48.31 8.81,47.82 8.81,47.82
$5N7428: length 4.2
  Top Layer w0.254: 7.28,39.99 7.25,40.02 6.01,40.02 6.17,40.17 6.17,42.84
$5N10266: length 4.5
  Top Layer w0.254: 8.34,55.68 8.34,54.8 7.78,54.23 ; 8.85,52.44 8.81,52.48 7.55,52.48 ; 7.55,52.48 7.55,53.93 ; 7.55,52.48 7.53,52.47
$5N24892: length 6
  Top Layer w0.254: 7.84,55.7 7.84,54.94 7.64,54.74 6.72,54.74 6.2,54.22 ; 6.04,53.96 6.04,52.66 6.08,52.63 5.99,52.55 4.11,52.55
$5N24922: length 12.7
  Top Layer w0.254: 12.22,59.76 13.6,59.76 13.68,59.84 14.47,59.84 14.6,59.71 14.6,52.63 14.78,52.46 15.15,52.46 15.16,52.45 ; 10.35,58.7 11.32,58.7 11.5,58.88 11.5,59.35 11.91,59.76 12.16,59.76
$7N698: length 5.4
  Top Layer w0.254: 37.97,42.52 37.97,43.81 38.21,44.05 41.89,44.05 41.97,44.13
$7N703: length 37.1
  Top Layer w0.254: 39.22,47.94 39.22,46 39.61,45.61 41.86,45.61 ; v1(44.17,64.49) 44.17,70.59 46.04,72.45 46.04,74.76 45.74,75.06 45.2,75.06
  Bottom Layer w0.254: v1(44.17,64.49) 44.19,64.47 44.19,50.29 42,48.1 42,46.22 41.36,45.58 v1(41.04,45.58)
$7N704: length 2.1
  Top Layer w0.254: 42.89,73.8 45.01,73.8
$7N705: length 57.5
  Top Layer w0.254: v1(11.92,69.04) 11.92,69.79 11.9,69.82 ; 39.88,47.57 39.91,47.55 v1(39.91,46.75)
  Bottom Layer w0.254: v1(39.91,46.75) 39.91,48.64 43.15,51.88 43.15,63.43 42.32,64.26 37.94,64.26 36.81,65.4 36.81,69.8 36.48,70.13 28.87,70.13 26.82,68.08 12.89,68.08 v1(11.92,69.04)
$7N706: length 54.5
  Top Layer w0.254: v1(41.64,49.11) 40.99,48.46 40.57,48.46 ; 13.28,69.76 13.28,69.08 v1(13.33,69.03)
  Bottom Layer w0.254: v1(41.64,49.11) 43.66,51.13 43.66,63.77 42.66,64.77 38.17,64.77 37.31,65.63 37.31,70.16 36.98,70.5 28.69,70.5 26.63,68.43 13.93,68.43 v1(13.33,69.03)
$7N1635: length 1.6
  Top Layer w0.254: 34.71,48.1 34.61,48 33.19,48
$7N4477: length 3.1
  Top Layer w0.254: 35.4,47.75 35.4,47.16 34.75,46.52 33.26,46.52 33.19,46.59

## Copper pours and planes (outline as drawn; the poured copper is in the pictures)
5V on Top Layer: 6.7,66.79 8.44,66.79 8.44,59.5 6.7,59.5
5V on Top Layer: 24.15,75.77 26.7,75.77 26.7,72.59 24.15,72.59
5V on Top Layer: 38.45,62.78 40.53,62.78 40.53,61.58 38.45,61.58
5V on Top Layer: 19.18,70.94 25.02,70.94 25.02,68.77 19.18,68.77
5V on Top Layer: 38.24,66.25 39.77,66.25 39.77,61.59 38.24,61.59
5V on Top Layer: 41.26,66.26 42.96,66.26 42.96,61.65 41.26,61.65
5V on Top Layer: 7.96,69.35 20.81,69.35 20.81,65.06 7.96,65.06
5V on Bottom Layer: 19.21,70.91 25.03,70.91 25.03,68.94 19.21,68.94
5V on Bottom Layer: 38.07,66.29 43.37,66.29 43.37,65.4 38.07,65.4
+15V on Top Layer: 11.92,51.56 14.42,51.56 14.42,46.53 11.92,46.53
-15V on Top Layer: 5.06,51.53 7.47,51.53 7.47,46.57 5.06,46.57
GND on Top Layer: -5.64,86.24 52.67,86.24 52.67,-5.85 -5.64,-5.85
GND on Top Layer: 32.71,73.94 32.71,73.49 27.83,68.61 27.83,59.77 28.56,59.04 31.4,59.04 32.22,59.86 32.22,64.13 37.83,69.74 37.83,73.71 37.24,74.3 33.07,74.3
GND on Bottom Layer: -8.39,88.49 51.67,88.49 51.67,-4.35 -8.39,-4.35
VDD12 on Top Layer: 37.89,60.49 39.25,60.49 39.25,56.07 37.89,56.07
VDD33 on Top Layer: 41.27,60.36 42.71,60.36 42.71,56.04 41.27,56.04
+VO on Top Layer: 22.92,35.68 30.58,35.68 30.58,23.13 22.92,23.13
+VO on Top Layer: 9.45,43.94 13.73,43.94 13.73,42.39 9.45,42.39
+VO on Top Layer: 9.45,42.72 13.12,42.72 13.12,39.44 9.45,39.44
-VO on Top Layer: 1.49,42.72 5.16,42.72 5.16,39.44 1.49,39.44
-VO on Top Layer: 6.24,35.79 13.9,35.79 13.9,23.24 6.24,23.24
-VO on Top Layer: 1.49,43.93 5.77,43.93 5.77,42.38 1.49,42.38
V-BAK on Top Layer: 21.03,79.05 22.09,79.05 22.09,76.66 21.03,76.66
V-BAK on Top Layer: 21.83,78.22 26.75,78.22 26.75,76.69 21.83,76.69
V-BAK on Top Layer: 10.46,77.07 22.09,77.07 22.09,75.48 10.46,75.48
V-MAIN on Top Layer: 27.39,77.01 37.28,77.01 37.28,75.22 27.39,75.22
$5N7405 on Top Layer: 9.19,63.17 17.33,63.17 17.33,58.06 9.19,58.06
$5N7408 on Top Layer: 1.96,63.04 7.53,63.04 7.53,55.05 1.96,55.05
$5N7706 on Top Layer: 19.41,75.61 23.67,75.61 23.67,72.83 19.41,72.83
$5N24892 on Top Layer: 2.37,55.58 5.99,55.58 5.99,50.41 2.37,50.41
$5N24922 on Top Layer: 13.37,55.67 17.51,55.67 17.51,50.48 13.37,50.48

Small or netless copper shapes (teardrops, artwork), in the pictures only: 259 on Top Layer, 79 on Bottom Layer

## Text on the board
Bottom Silkscreen Layer: DESIGNED BY FANGXX3863 | HIFI-USB-DAC
Document Layer: 由于外壳限高，这里电容必须放倒焊接 / 并且选择的电容直径不大于6.3mm
Top Silkscreen Layer: JLCJLCJLCJLC
